# EAGLE schematic Tractive System Schematic (EAGLE 9.6.2)
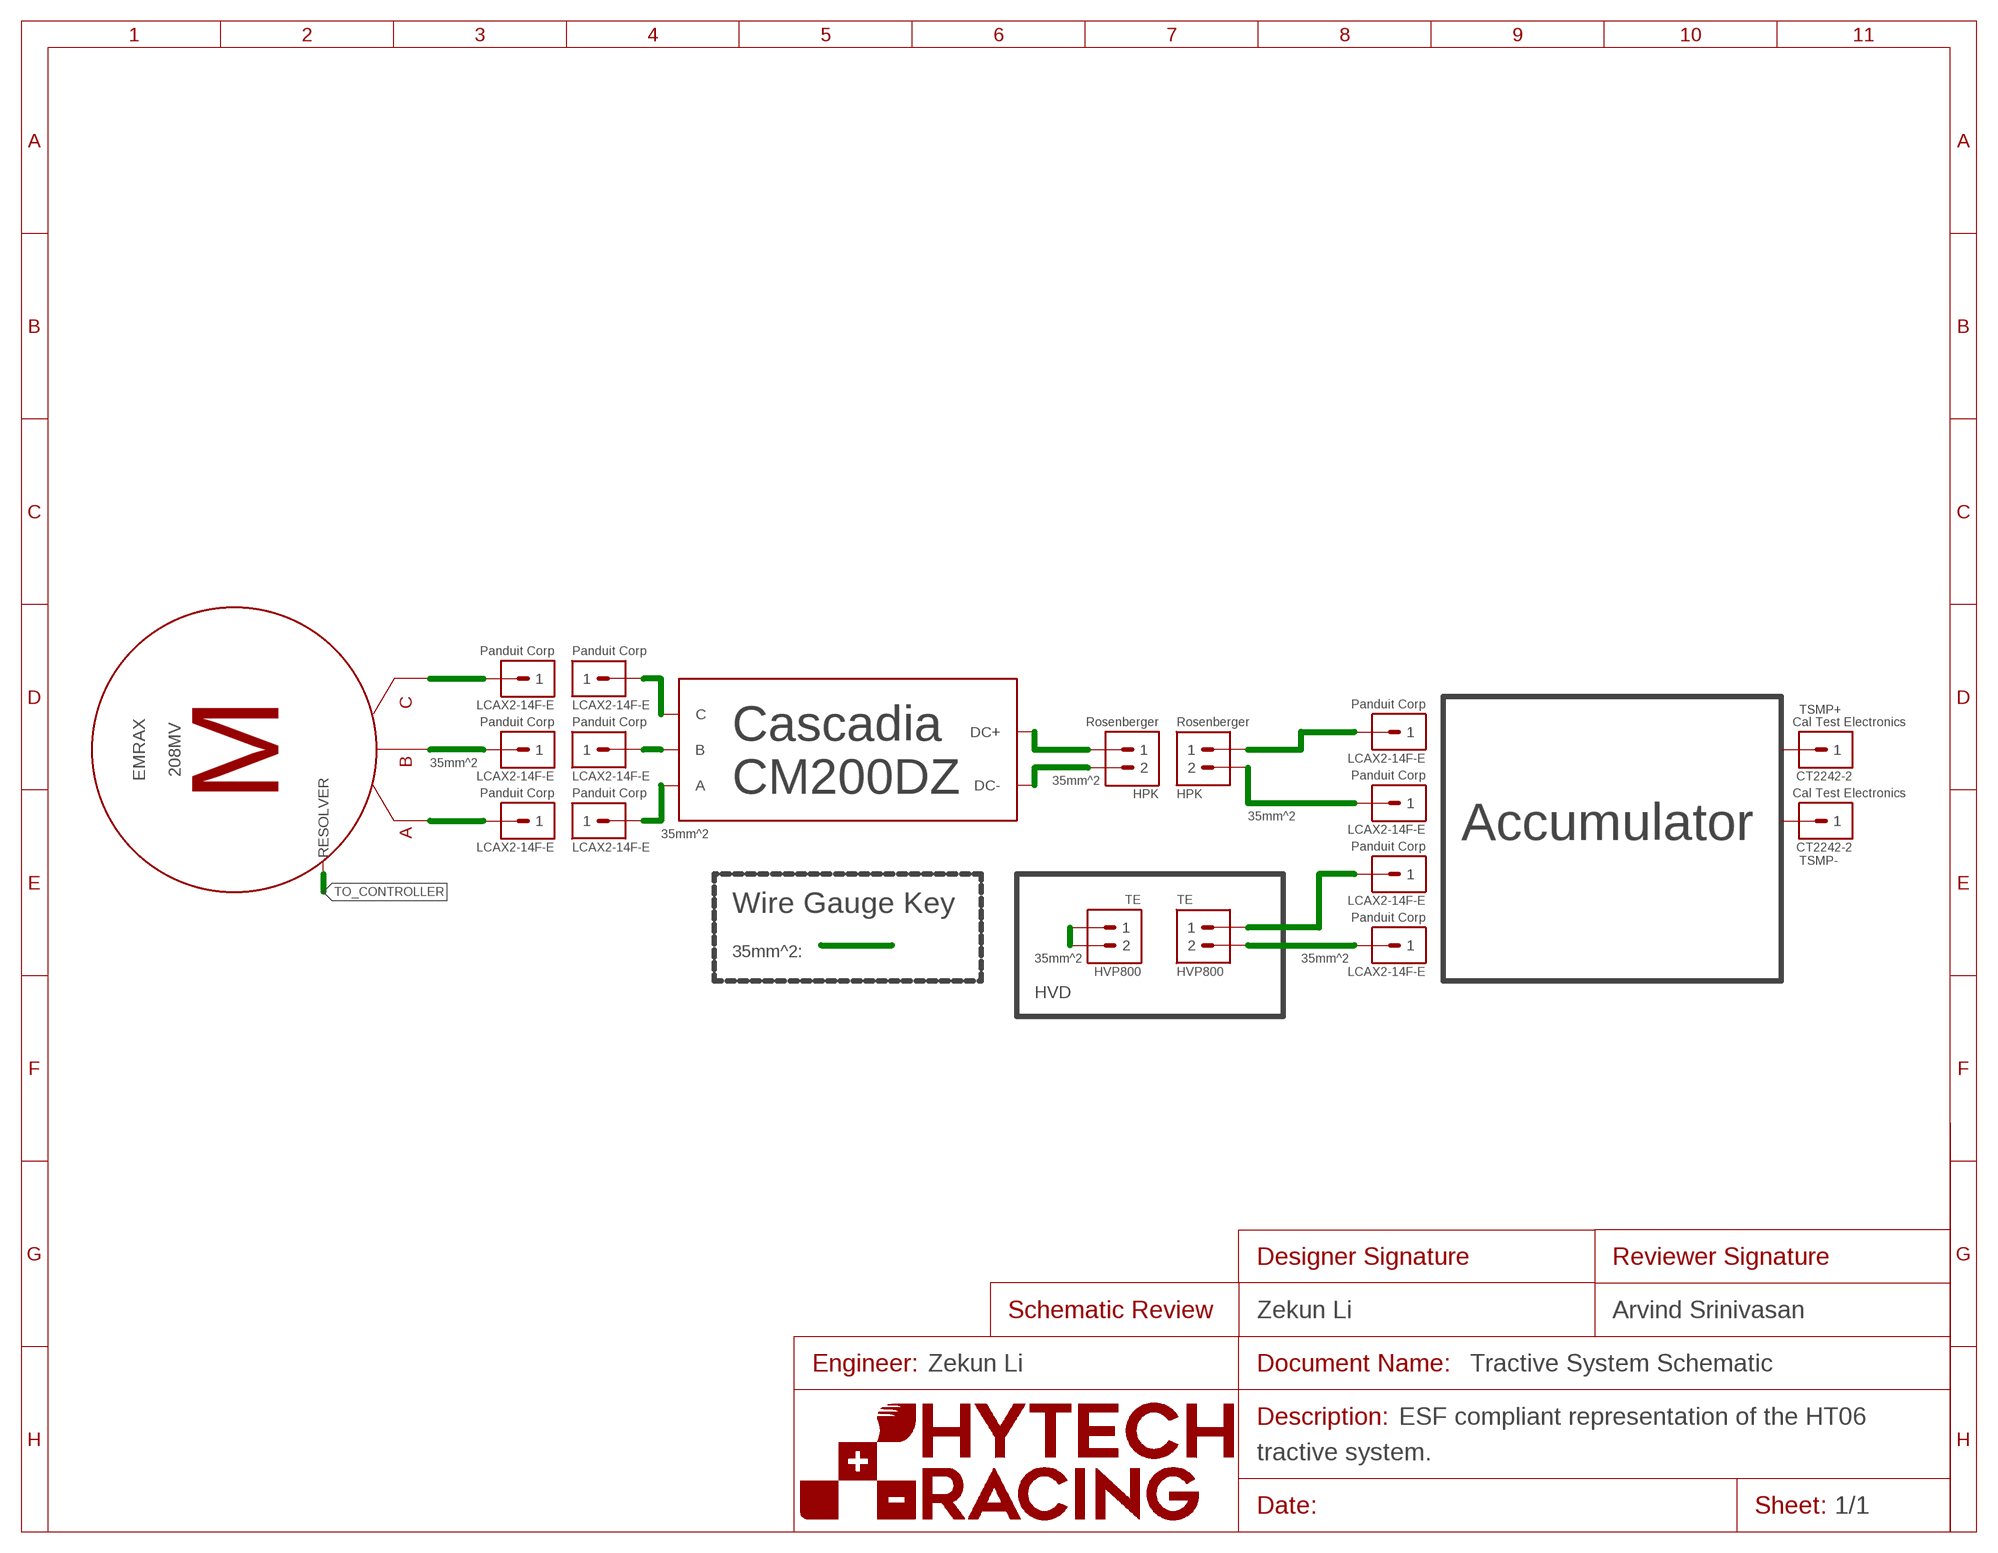
[diagram p0: schematic, sheet 1]
U$4 (FRAME_SCHEMATIC_ONLY): DESCRIPTION_1: ESF compliant representation of the HT06; DESCRIPTION_2: tractive system.; DESIGNER_SCHEMATIC: Zekun Li; ENGINEER: Zekun Li; REVIEWER_SCHEMATIC: Arvind Srinivasan

## Parts
J1  CONNECTOR-1_CT2242-2  (no package)
J2  CONNECTOR-1_LCAX2-14F-E  (no package)
J3  CONNECTOR-1_CT2242-2  (no package)
J4  CONNECTOR-1_LCAX2-14F-E  (no package)
J5  CONNECTOR-1_LCAX2-14F-E  (no package)
J6  CONNECTOR-1_LCAX2-14F-E  (no package)
J7  CONNECTOR-1_LCAX2-14F-E  (no package)
J8  CONNECTOR-1_LCAX2-14F-E  (no package)
J9  CONNECTOR-1_LCAX2-14F-E  (no package)
J10  CONNECTOR-1_LCAX2-14F-E  (no package)
J12  CONNECTOR-1_LCAX2-14F-E  (no package)
J14  CONNECTOR-1_LCAX2-14F-E  (no package)
U$1  CASCADIA_CM200DZ_SIMPLE  (no package)
U$2  CONNECTOR-2_HPK  (no package)
U$3  CONNECTOR-2_HPK  (no package)
U$5  MOTOR_AC_EMRAX_208  (no package)
U$6  CONNECTOR-2_HVP800  (no package)
U$7  CONNECTOR-2_HVP800  (no package)

## Nets
N$1: U$1.DC+ U$2.1
N$2: U$1.DC- U$2.2
N$3: J14.1 U$6.1
N$9: J9.1 U$1.A
N$10: J5.1 U$1.B
N$11: J7.1 U$1.C
N$12: J12.1 U$3.2
N$14: U$7.1 U$7.2
N$15: J2.1 U$3.1
N$16: J4.1 U$6.2
N$17: J10.1 U$5.A
N$18: J6.1 U$5.B
N$19: J8.1 U$5.C
TO_CONTROLLER: U$5.RESOLVER
Unconnected: J1.1 J3.1

## Notes on the sheet
- TSMP+
- 35mm^2
- 35mm^2
- Accumulator
- 35mm^2
- 35mm^2
- TSMP-
- Wire Gauge Key
- 35mm^2:
- 35mm^2 | 35mm^2
- HVD

## Library data of the parts
J1 J3 = HyTechSymbolsTemp:CONNECTOR-1_*: Single pin connector CT2242-2 <https://drive.google.com/file/d/1rFz1F44pFGMLks1TuzNftb-wQBk0xWUD/view> LCAX2-14F-E <https://drive.google.com/file/d/1bbvHAAOUtBwm4fAPUWES_iBsARNVuAgN/view>; MANUFACTURER: Cal Test Electronics; MPN: CT2242-2
J2 J4-J10 J12 J14 = HyTechSymbolsTemp:CONNECTOR-1_*: Single pin connector CT2242-2 <https://drive.google.com/file/d/1rFz1F44pFGMLks1TuzNftb-wQBk0xWUD/view> LCAX2-14F-E <https://drive.google.com/file/d/1bbvHAAOUtBwm4fAPUWES_iBsARNVuAgN/view>; MANUFACTURER: Panduit Corp; MPN: LCAX2-14F-E
U$1 = HyTechSymbolsTemp:CASCADIA_CM200DZ_SIMPLE: Cascaida Motion CM200DZ Motor Inverter Product Page <https://www.cascadiamotion.com/productlist/8-inverters/pm-inverters/49-cm200> Datasheet <https://www.cascadiamotion.com/images/catalog/DataSheets/CM200.pdf>
U$2 U$3 = HyTechSymbolsTemp:CONNECTOR-2_*: Two pin connector EVH2-N2TK-TDA <https://drive.google.com/file/d/1gQfuywpa-Tm7bohh-tcSjjxbyqcnD_h9/view> HPK <https://drive.google.com/file/d/1jTQMZ26zoHotHQHZYMoMT2jUzRt664sO/view> HVP800 <https://drive.google.com/file/d/1j-HswfqYHj8usJ9E3bf8NWBzB-X0BKJ4/view>; MANUFACTURER: Rosenberger; MPN: HPK
U$5 = HyTechSymbols:MOTOR_AC_*: Generic three-phase AC electric motor; MANUFACTURER: EMRAX; MPN: 208MV
U$6 U$7 = HyTechSymbolsTemp:CONNECTOR-2_*: Two pin connector EVH2-N2TK-TDA <https://drive.google.com/file/d/1gQfuywpa-Tm7bohh-tcSjjxbyqcnD_h9/view> HPK <https://drive.google.com/file/d/1jTQMZ26zoHotHQHZYMoMT2jUzRt664sO/view> HVP800 <https://drive.google.com/file/d/1j-HswfqYHj8usJ9E3bf8NWBzB-X0BKJ4/view>; MANUFACTURER: TE; MPN: HVP800